# Altium schematic sheet Force Sensor Tests Schematic.SchDoc
size A4
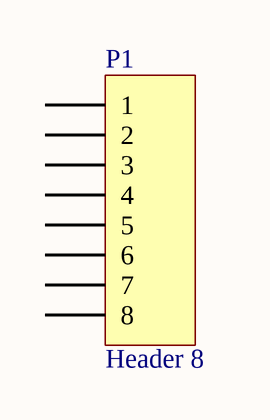
[diagram p0: Force Sensor Tests Schematic.SchDoc]

## Parts
P1  Header 8  [HDR1X8]

## Nets

Not connected (* = marked no-connect by the designer): P1 1 2 3 4 5 6 7 8

## Library data of the parts
P1 = Header 8: Header, 8-Pin; LatestRevisionDate: 17-Jul-2002; LatestRevisionNote: Re-released for DXP Platform.; Publisher: Altium Limited